# EAGLE design canBLC (EAGLE 5.11)
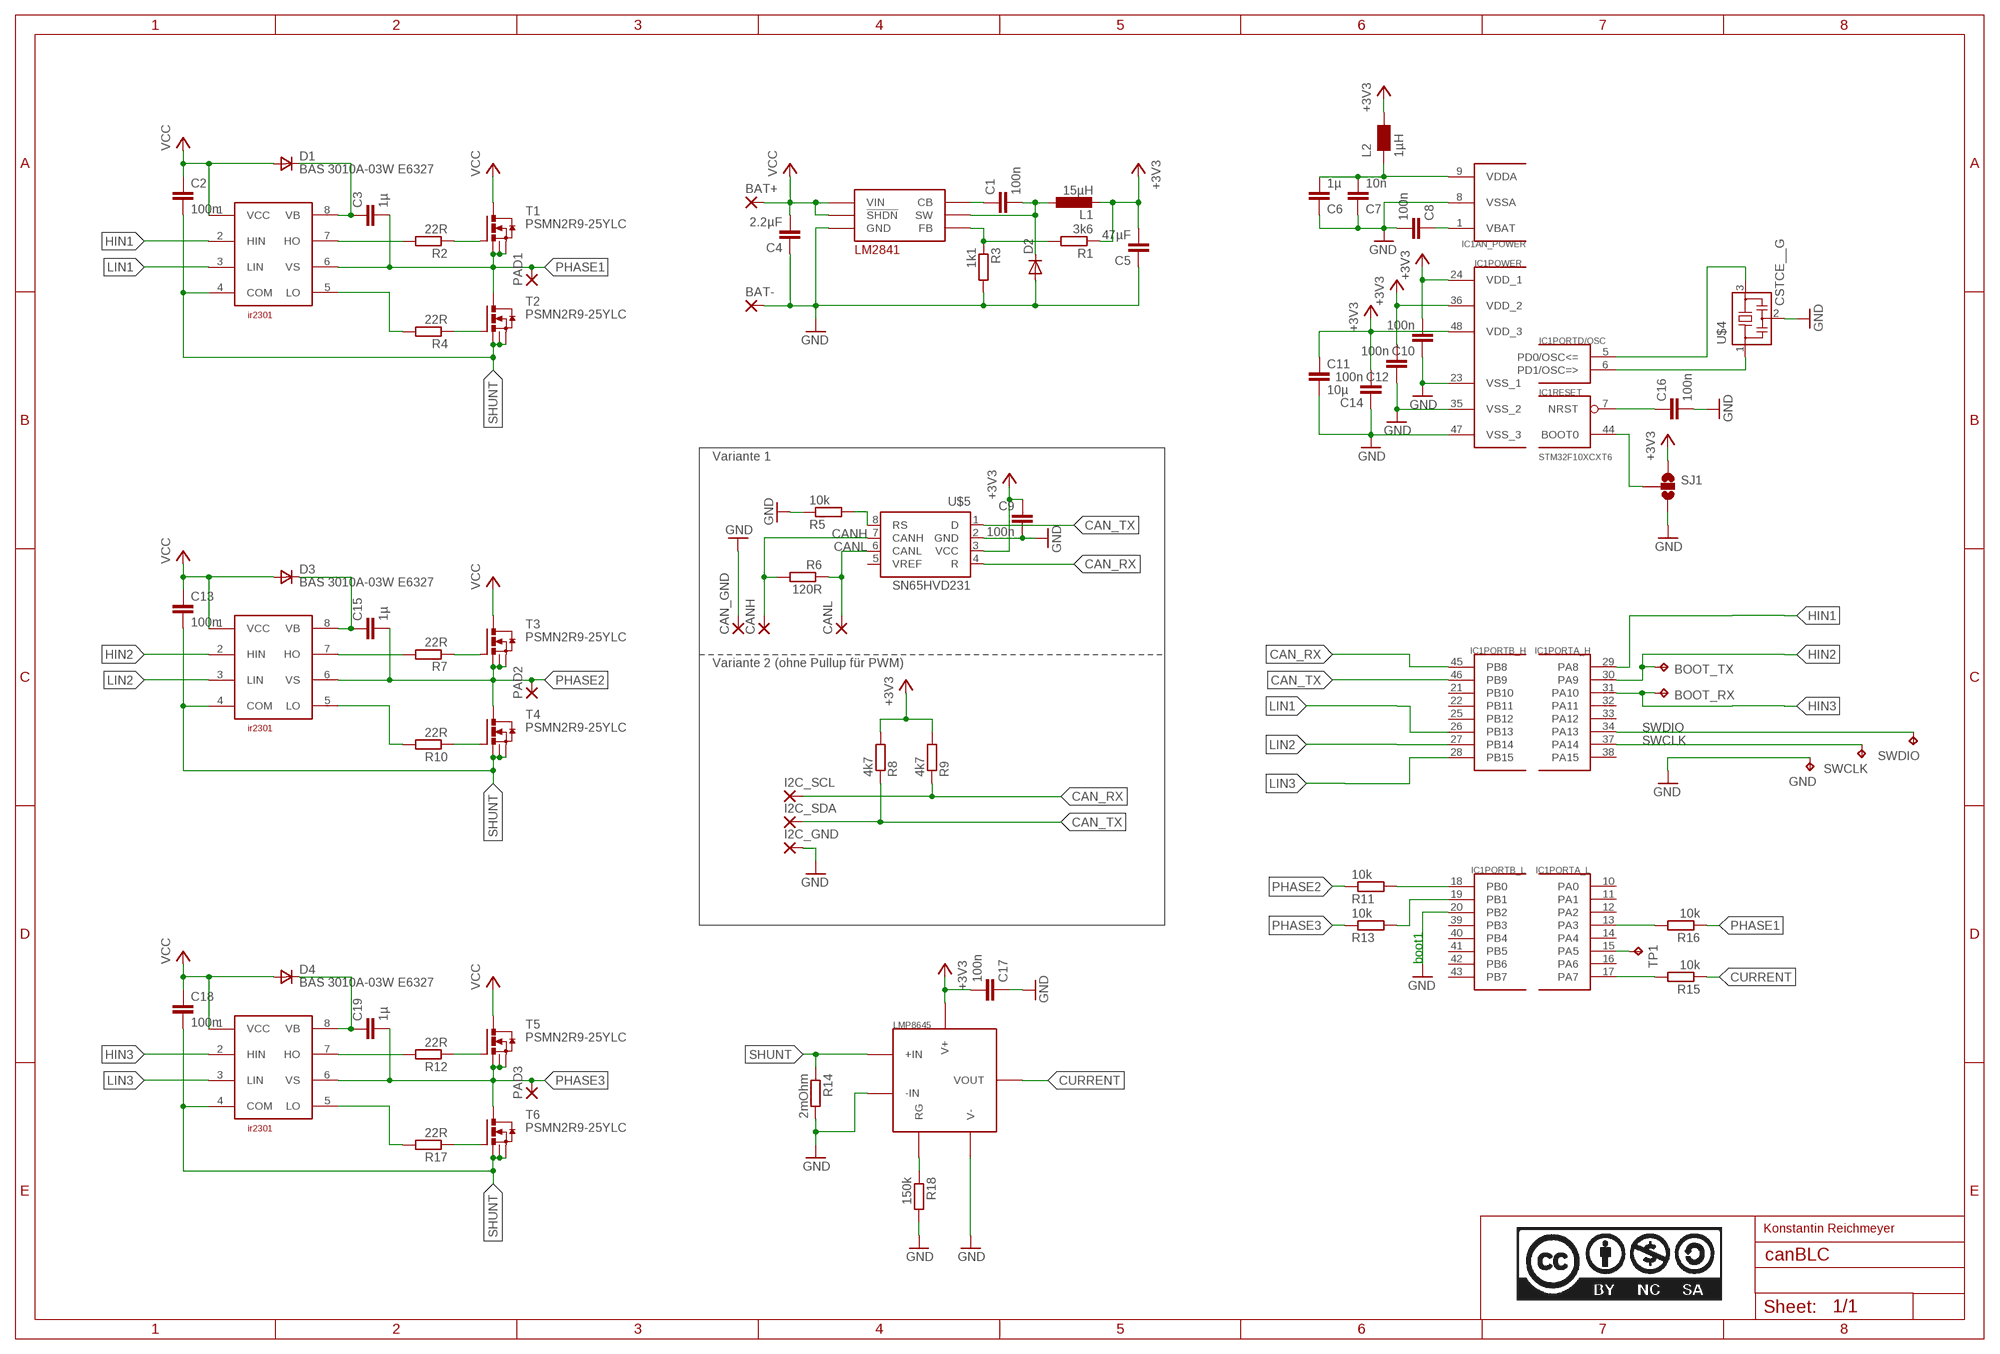
[diagram p0: schematic, sheet 1]

## Parts
BAT+  SMD5  [SMD2,54-5,08]
BAT-  SMD5  [SMD2,54-5,08]
BOOT_RX  TPB1,27  [B1,27]
BOOT_TX  TPB1,27  [B1,27]
C1  100n  C-EUC0805  [C0805]
C2  100n  C-EUC0805  [C0805]
C3  1µ  C-EUC0805  [C0805]
C4  2.2µF  C-EUC1206  [C1206]
C5  47µF  C-EUC1210  [C1210]
C6  1µ  C-EUC0805  [C0805]
C7  10n  C-EUC0805  [C0805]
C8  100n  C-EUC0805  [C0805]
C9  100n  C-EUC0805  [C0805]
C10  100n  C-EUC0805  [C0805]
C11  10µ  C-EUC0805  [C0805]
C12  100n  C-EUC0805  [C0805]
C13  100n  C-EUC0805  [C0805]
C14  100n  C-EUC0805  [C0805]
C15  1µ  C-EUC0805  [C0805]
C16  100n  C-EUC0805  [C0805]
C17  100n  C-EUC0805  [C0805]
C18  100n  C-EUC0805  [C0805]
C19  1µ  C-EUC0805  [C0805]
CAN_GND  WIREPADSMD1,27-254  [SMD1,27-2,54]
CANH  WIREPADSMD1,27-254  [SMD1,27-2,54]
CANL  WIREPADSMD1,27-254  [SMD1,27-2,54]
D1  BAS 3010A-03W E6327  DSOD323  [SOD323]
D2  CGRM4001-G  [SOD-123_MINI-SMA]
D3  BAS 3010A-03W E6327  DSOD323  [SOD323]
D4  BAS 3010A-03W E6327  DSOD323  [SOD323]
GND  TPB1,27  [B1,27]
I2C_GND  WIREPADSMD1,27-254  [SMD1,27-2,54]
I2C_SCL  WIREPADSMD1,27-254  [SMD1,27-2,54]
I2C_SDA  WIREPADSMD1,27-254  [SMD1,27-2,54]
IC1  STM32F10XCXT6  [TQFP48]
L1  15µH  L-EUL1812  [L1812]
L2  1µH  WE-KI_0805_B  [WE-KI_0805_B]
PAD1  SMD5  [SMD2,54-5,08]
PAD2  SMD5  [SMD2,54-5,08]
PAD3  SMD5  [SMD2,54-5,08]
R1  3k6  R-EU_R0805  [R0805]
R2  22R  R-EU_R0805  [R0805]
R3  1k1  R-EU_R0805  [R0805]
R4  22R  R-EU_R0805  [R0805]
R5  10k  R-EU_R0805  [R0805]
R6  120R  R-EU_R0805  [R0805]
R7  22R  R-EU_R0805  [R0805]
R8  4k7  R-EU_R0805  [R0805]
R9  4k7  R-EU_R0805  [R0805]
R10  22R  R-EU_R0805  [R0805]
R11  10k  R-EU_R0805  [R0805]
R12  22R  R-EU_R0805  [R0805]
R13  10k  R-EU_R0805  [R0805]
R14  2mOhm  R-EU_R2512  [R2512]
R15  10k  R-EU_R0805  [R0805]
R16  10k  R-EU_R0805  [R0805]
R17  22R  R-EU_R0805  [R0805]
R18  150k  R-EU_R0805  [R0805]
SJ1  SOLDERJUMPER_2WAYPASTE1&2  [SJ_3_PASTE1&2]
SWCLK  TPB1,27  [B1,27]
SWDIO  TPB1,27  [B1,27]
T1  PSMN2R9-25YLC  [SOT669]
T2  PSMN2R9-25YLC  [SOT669]
T3  PSMN2R9-25YLC  [SOT669]
T4  PSMN2R9-25YLC  [SOT669]
T5  PSMN2R9-25YLC  [SOT669]
T6  PSMN2R9-25YLC  [SOT669]
TP1  TPB1,27  [B1,27]
U1  IR2301  [SO08]
U2  IR2301  [SO08]
U3  IR2301  [SO08]
U$1  LM2841  [TSOP-6]
U$4  CSTCE__G  [CSTCE__G]
U$5  SN65HVD231  [SO-08]
U$9  LMP8645  [TSOP-6]

## Nets
+3V3: C5.2 C9.1 C10.2 C11.1 C12.2 C14.2 C17.2 IC1.24(POWER:VDD_1) IC1.36(POWER:VDD_2) IC1.48(POWER:VDD_3) L1.2 L2.1 R1.1 R8.2 R9.2 SJ1.1 U$5.3(VCC) U$9.6(V+)
CAN_RX: I2C_SCL.1(P) IC1.45(PORTB_H:PB8) R9.1 U$5.4(R)
CAN_TX: I2C_SDA.1(P) IC1.46(PORTB_H:PB9) R8.1 U$5.1(D)
CANH: CANH.1(P) R6.2 U$5.7(CANH)
CANL: CANL.1(P) R6.1 U$5.6(CANL)
CURRENT: R15.1 U$9.1(VOUT)
GND: BAT-.1(P) C4.1 C5.1 C6.1 C7.1 C8.2 C9.2 C10.1 C11.2 C12.1 C14.1 C16.2 C17.1 CAN_GND.1(P) D2.A GND.TP I2C_GND.1(P) IC1.8(AN_POWER:VSSA) IC1.20(PORTB_L:PB2) IC1.23(POWER:VSS_1) IC1.35(POWER:VSS_2) IC1.47(POWER:VSS_3) R3.2 R5.1 R14.2 R18.2 SJ1.3 U$1.2(GND) U$4.2 U$5.2(GND) U$9.2(V-) U$9.4(-IN)
HIN1: IC1.29(PORTA_H:PA8) U1.2(HIN)
HIN2: BOOT_TX.TP IC1.30(PORTA_H:PA9) U2.2(HIN)
HIN3: BOOT_RX.TP IC1.31(PORTA_H:PA10) U3.2(HIN)
LIN1: IC1.26(PORTB_H:PB13) U1.3(LIN)
LIN2: IC1.27(PORTB_H:PB14) U2.3(LIN)
LIN3: IC1.28(PORTB_H:PB15) U3.3(LIN)
N$2: R2.1 T1.4(G)
N$3: R4.1 T2.4(G)
N$4: R2.2 U1.7(HO)
N$5: R4.2 U1.5(LO)
N$6: C16.1 IC1.7(RESET:NRST)
N$7: IC1.5(PORTD/OSC:PD0/OSC<=) U$4.3
N$8: R5.2 U$5.8(RS)
N$9: R7.1 T3.4(G)
N$10: R10.1 T4.4(G)
N$11: R7.2 U2.7(HO)
N$12: R10.2 U2.5(LO)
N$13: IC1.18(PORTB_L:PB0) R11.2
N$14: IC1.19(PORTB_L:PB1) R13.2
N$15: IC1.13(PORTA_L:PA3) R16.2
N$16: IC1.17(PORTA_L:PA7) R15.2
N$17: R12.1 T5.4(G)
N$18: R17.1 T6.4(G)
N$19: R12.2 U3.7(HO)
N$20: R17.2 U3.5(LO)
N$21: IC1.15(PORTA_L:PA5) TP1.TP
N$22: IC1.6(PORTD/OSC:PD1/OSC=>) U$4.1
N$24: C8.1 IC1.1(AN_POWER:VBAT)
N$30: C6.2 C7.2 IC1.9(AN_POWER:VDDA) L2.2
N$31: IC1.44(RESET:BOOT0) SJ1.2
N$34: R18.1 U$9.5(RG)
N$35: C1.1 U$1.1(CB)
N$37: R1.2 R3.1 U$1.3(FB)
N$38: C1.2 D2.C L1.1 U$1.6(SW)
PHASE1: C3.2 PAD1.1(P) R16.1 T1.1(S) T1.2(S1) T1.3(S2) T2.5(D) U1.6(VS)
PHASE2: C15.2 PAD2.1(P) R11.1 T3.1(S) T3.2(S1) T3.3(S2) T4.5(D) U2.6(VS)
PHASE3: C19.2 PAD3.1(P) R13.1 T5.1(S) T5.2(S1) T5.3(S2) T6.5(D) U3.6(VS)
SHUNT: C2.2 C13.2 C18.2 R14.1 T2.1(S) T2.2(S1) T2.3(S2) T4.1(S) T4.2(S1) T4.3(S2) T6.1(S) T6.2(S1) T6.3(S2) U1.4(COM) U2.4(COM) U3.4(COM) U$9.3(+IN)
SWCLK: IC1.37(PORTA_H:PA14) SWCLK.TP
SWDIO: IC1.34(PORTA_H:PA13) SWDIO.TP
VB1: C3.1 D1.1(C) U1.8(VB)
VB2: C15.1 D3.1(C) U2.8(VB)
VB3: C19.1 D4.1(C) U3.8(VB)
VCC: BAT+.1(P) C2.1 C4.2 C13.1 C18.1 D1.2(A) D3.2(A) D4.2(A) T1.5(D) T3.5(D) T5.5(D) U1.1(VCC) U2.1(VCC) U3.1(VCC) U$1.4(!SHDN) U$1.5(VIN)
Unconnected: IC1.2(PORTC:PC13) IC1.3(PORTC:PC14) IC1.4(PORTC:PC15) IC1.10(PORTA_L:PA0) IC1.11(PORTA_L:PA1) IC1.12(PORTA_L:PA2) IC1.14(PORTA_L:PA4) IC1.16(PORTA_L:PA6) IC1.21(PORTB_H:PB10) IC1.22(PORTB_H:PB11) IC1.25(PORTB_H:PB12) IC1.32(PORTA_H:PA11) IC1.33(PORTA_H:PA12) IC1.38(PORTA_H:PA15) IC1.39(PORTB_L:PB3) IC1.40(PORTB_L:PB4) IC1.41(PORTB_L:PB5) IC1.42(PORTB_L:PB6) IC1.43(PORTB_L:PB7) U$5.5(VREF)

## Notes on the sheet
- Variante 1
- Variante 2 (ohne Pullup für PWM)
- boot1
- Konstantin Reichmeyer

## Library data of the parts
BAT+ BAT- PAD1-PAD3 = wirepad:SMD5: SMD PAD
BOOT_RX BOOT_TX GND SWCLK SWDIO TP1 = testpad:TP: Test pad
C1-C19 = rcl:C-EU: CAPACITOR, European symbol
CAN_GND CANH CANL I2C_GND I2C_SCL I2C_SDA = wirepad:WIREPAD: Wire PAD connect wire on PCB
D1 D3 D4 = zetex:D: DIODE; MPN: CDSOD323-T05C; OC_FARNELL: 1824860; OC_NEWARK: 79R6078
D2 = diode:CGRM400*-G: Molded plasitc,JEDEC SOD-123/Mini SMA Source: Comchip CGRM4001-G.pdf
IC1 = stm32:STM32F10XCXT6: ST STM32F101/103 48pin LQFP
L1 = rcl:L-EU: INDUCTOR, European symbol
L2 = wuerth-elektronik:WE-KI: SMD Wire Wound Ceramic Inductor WE-KI - Wire wound - High thermal stability - Rated current up to 1 A - High Q-factor - High SRF -- Especially developed for high frequency applications -- Perfect for applications in telecommunications -- Bluetooth -- Wireless LAN
R1-R18 = rcl:R-EU_: RESISTOR, European symbol
SJ1 = SparkFun:SOLDERJUMPER_2WAY: Solder Jumper 2 way solder jumper
T1-T6 = PSMN2R9-25YLC:PSMN2R9-25YLC
U1-U3 = ir:IR2301
U$1 = lm2841:LM2841
U$4 = murata-filter:CSTCE__G
U$5 = texas:SN65HVD231: 3.3-V CAN TRANSCEIVER http://focus.ti.com/lit/ds/symlink/sn65hvd232.pdf
U$9 = lmp8645:LMP8645

## Board
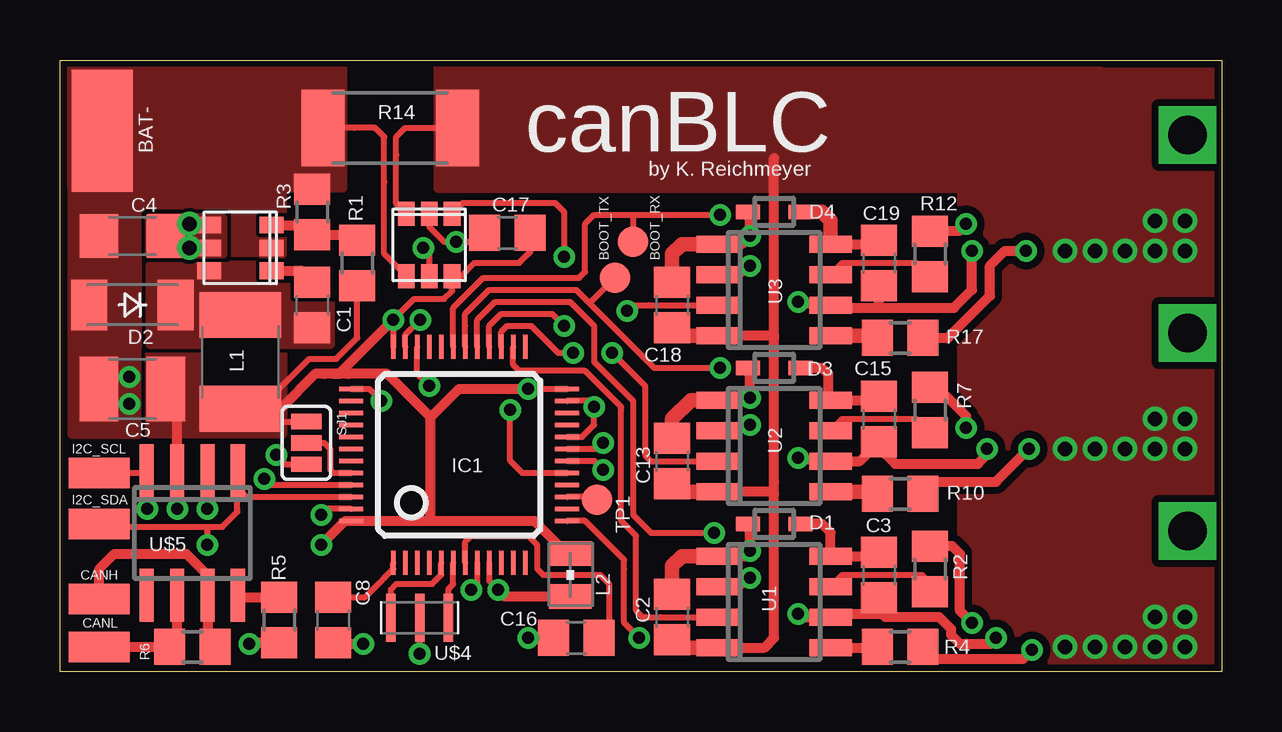
[diagram p1: board, top side]
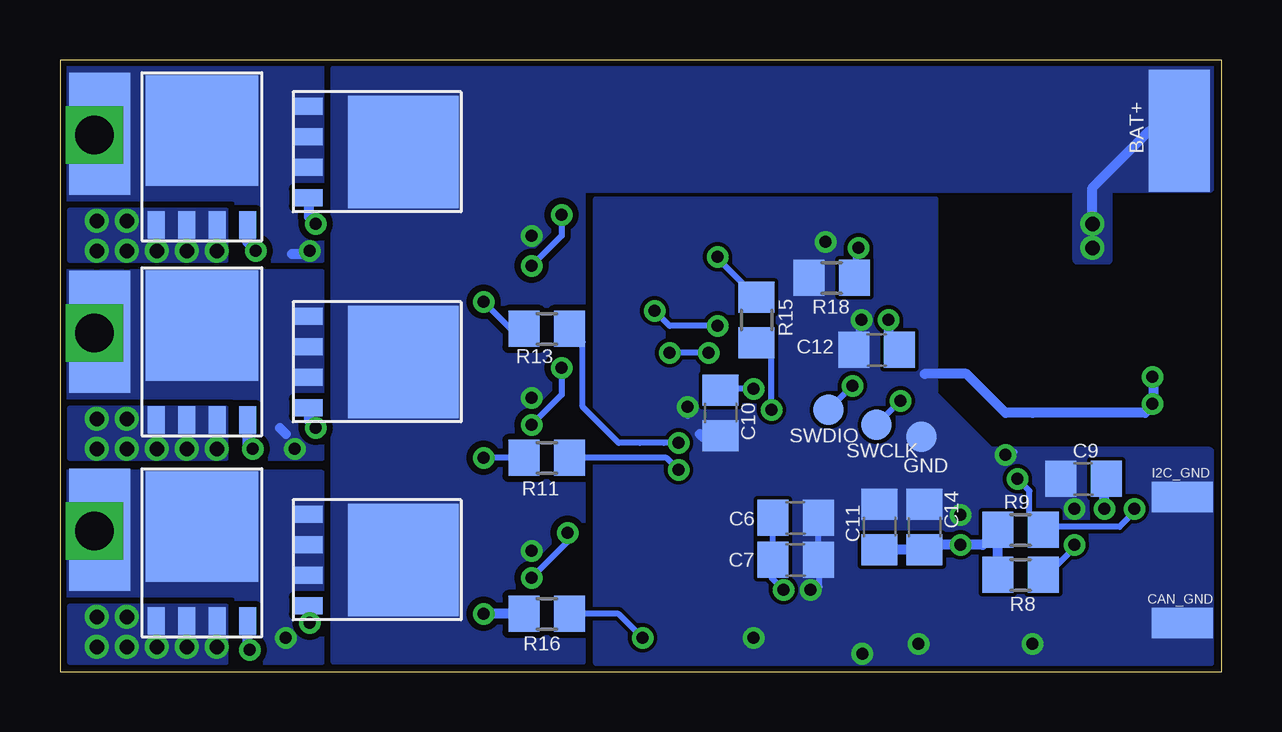
[diagram p2: board, bottom side, seen from below]

Size 48.43 x 25.49 mm. Coordinates in mm from the lower left corner, seen from the top.
Outline: 0,0 0,25.49 48.43,25.49 48.43,0 0,0
Copper layers (1*16): Top 0.035mm / dielectric 1.5mm / Bottom 0.035mm
Design rules "default *": minimum track width 6mil, minimum drill 19mil, track to track 6mil, track to pad 6mil, pad to pad 6mil, via to via 6mil, smd to smd 0mil, copper to edge 10mil, drill to drill 8mil, minimum pad ring 10mil, minimum via ring 8mil, stop-mask expansion 4mil, vias tented up to drill 0.6mm, thermal gap 10mil
tRestrict: area 5.9,11.9 to 9.1,13.9
bRestrict: area 5.9,11.9 to 9.1,13.9

### Footprints (pad centres in the part's own frame; a part is rotated, then mirrored left to right if it is on the bottom)
SMD2,54-5,08 = smd 2.54 x 5.08: 1 0,0
B1,27 = smd 1.27 x 1.27: TP 0,0
C0805 = smd 1.3 x 1.5: 1 -0.95,0; 2 0.95,0
C1206 = smd 1.6 x 1.8: 1 -1.4,0; 2 1.4,0
C1210 = smd 1.6 x 2.7: 1 -1.4,0; 2 1.4,0
SMD1,27-2,54 = smd 1.27 x 2.54: 1 0,0
SOD323 = smd 1 x 0.6: 1 -1.1,0; 2 1.1,0
SOD-123_MINI-SMA = smd 1.5 x 2.1: A 1.8,0; C -1.8,0
TQFP48 = smd 0.2 x 1: 1 -2.75,-4.5; 2 -2.25,-4.5; 3 -1.75,-4.5; 4 -1.25,-4.5; 5 -0.75,-4.5; 6 -0.25,-4.5; 7 0.25,-4.5; 8 0.75,-4.5; 9 1.25,-4.5; 10 1.75,-4.5; 11 2.25,-4.5; 12 2.75,-4.5; 25 2.75,4.5; 26 2.25,4.5; 27 1.75,4.5; 28 1.25,4.5; 29 0.75,4.5; 30 0.25,4.5; 31 -0.25,4.5; 32 -0.75,4.5; 33 -1.25,4.5; 34 -1.75,4.5; 35 -2.25,4.5; 36 -2.75,4.5 | smd 1 x 0.2: 13 4.5,-2.75; 14 4.5,-2.25; 15 4.5,-1.75; 16 4.5,-1.25; 17 4.5,-0.75; 18 4.5,-0.25; 19 4.5,0.25; 20 4.5,0.75; 21 4.5,1.25; 22 4.5,1.75; 23 4.5,2.25; 24 4.5,2.75; 37 -4.5,2.75; 38 -4.5,2.25; 39 -4.5,1.75; 40 -4.5,1.25; 41 -4.5,0.75; 42 -4.5,0.25; 43 -4.5,-0.25; 44 -4.5,-0.75; 45 -4.5,-1.25; 46 -4.5,-1.75; 47 -4.5,-2.25; 48 -4.5,-2.75
L1812 = smd 1.9 x 3.4: 1 -1.95,0; 2 1.95,0
WE-KI_0805_B = smd 1.02 x 1.78: 1 -0.89,0; 2 0.89,0
R0805 = smd 1.3 x 1.5: 1 -0.95,0; 2 0.95,0
R2512 = smd 1.8 x 3.2: 1 -2.8,0; 2 2.8,0
SJ_3_PASTE1&2 = smd 0.635 x 1.27: 1 -0.889,0; 2 0,0; 3 0.889,0
SOT669 = smd 0.7 x 1.15: 1 -1.905,-2.54; 2 -0.635,-2.54; 3 0.635,-2.54; 4 1.905,-2.54 | smd 4.7 x 4.6: 5 0,1.397
SO08 = smd 0.72 x 1.78: 1 -1.905,-2.35; 2 -0.635,-2.35; 3 0.635,-2.35; 4 1.905,-2.35; 5 1.905,2.35; 6 0.635,2.35; 7 -0.635,2.35; 8 -1.905,2.35
TSOP-6 = smd 0.69 x 1: 1 0.95,1.3; 2 0,1.3; 3 -0.95,1.3; 4 -0.95,-1.3; 5 0,-1.3; 6 0.95,-1.3
CSTCE__G = smd 0.4 x 2: 1 -1.2,0; 2 0,0; 3 1.2,0
SO-08 = smd 0.6 x 2.2: 1 -1.905,-2.6; 2 -0.635,-2.6; 3 0.635,-2.6; 4 1.905,-2.6; 5 1.905,2.6; 6 0.635,2.6; 7 -0.635,2.6; 8 -1.905,2.6

### Placement (x,y rotation side)
BAT+  1.77,22.54 180 bottom
BAT-  1.77,22.54 180 top
BOOT_RX  23.89,17.91 0 top
BOOT_TX  23.14,16.41 0 top
C1  10.52,15.29 270 top
C2  25.52,2.29 270 top
C3  34.14,4.04 270 top
C4  3.02,18.16 0 top
C5  3.02,11.79 0 top
C6  17.77,6.41 180 bottom
C7  17.77,4.66 180 bottom
C8  11.39,2.16 270 top
C9  5.77,8.04 180 bottom
C10  20.89,10.79 90 bottom
C11  14.27,6.04 90 bottom
C12  14.39,13.41 0 bottom
C13  25.52,8.79 270 top
C14  12.39,6.04 270 bottom
C15  34.14,10.54 270 top
C16  21.52,1.41 180 top
C17  18.64,18.29 0 top
C18  25.52,15.29 270 top
C19  34.14,17.04 270 top
CAN_GND  1.64,2.04 90 bottom
CANH  1.64,3.04 90 top
CANL  1.64,1.04 90 top
D1  29.77,6.16 180 top
D2  3.02,15.29 180 top
D3  29.77,12.66 180 top
D4  29.77,19.16 180 top
GND  12.52,9.79 0 bottom
I2C_GND  1.64,7.29 270 bottom
I2C_SCL  1.64,8.29 270 top
I2C_SDA  1.64,6.16 270 top
IC1  16.64,9.04 0 top
L1  7.52,12.91 270 top
L2  21.27,4.04 270 top
PAD1  46.77,5.91 180 bottom
PAD2  46.77,14.16 180 bottom
PAD3  46.77,22.41 180 bottom
R1  12.39,17.04 90 top
R2  36.27,4.29 270 top
R3  10.52,19.16 90 top
R4  35.02,1.04 180 top
R5  9.14,2.16 90 top
R6  5.52,1.04 0 top
R7  36.27,10.91 270 top
R8  8.39,4.04 180 bottom
R9  8.39,5.91 180 bottom
R10  35.02,7.41 180 top
R11  28.14,8.91 0 bottom
R12  36.27,17.41 270 top
R13  28.14,14.29 0 bottom
R14  13.77,22.66 180 top
R15  19.39,14.66 270 bottom
R16  28.14,2.41 0 bottom
R17  35.02,13.91 180 top
R18  16.27,16.41 180 bottom
SJ1  10.27,9.54 270 top
SWCLK  14.39,10.29 0 bottom
SWDIO  16.39,10.91 0 bottom
T1  35.52,4.66 270 bottom
T2  42.52,4.66 0 bottom
T3  35.52,12.91 270 bottom
T4  42.52,13.04 0 bottom
T5  35.52,21.66 270 bottom
T6  42.52,21.16 0 bottom
TP1  22.39,7.16 90 top
U1  29.77,2.91 270 top
U2  29.77,9.41 270 top
U3  29.77,15.91 270 top
U$1  7.52,17.66 270 top
U$4  14.99,2.25 180 top
U$5  5.52,5.79 180 top
U$9  15.39,17.79 0 top

### Tracks (layer width: path | path; a pad name or v marks a point on that pad's centre or on a via)
+3V3  (via drill 0.5)
  Top 0.254: IC1.24 20.14,11.79 20.02,11.79 v19.52,11.79 | v4.89,6.79 v4.88,6.8 | 4.88,10.53 4.89,10.54 | C17.2 19.59,17.49 19.52,17.41 19.14,17.04 17.27,17.04 16.72,16.49 U$9.6 16.34,15.86 16.02,15.54 14.77,15.54 v13.89,14.66 IC1.36 | SJ1.1 9.27,10.43 8.06,10.43 L1.2 | R1.1 12.39,13.91 11.52,13.04 10.39,13.04 9.02,11.66 9.02,11.59 8.39,10.96
  Top 0.406: v4.88,6.8 U$5.3 4.88,10.53 | L2.1 21.13,4.93 19.77,6.29 15.39,6.29 | 13.89,12.16 15.08,10.97 15.46,10.6 | 13.89,12.16 14.27,11.79 | 15.39,6.29 15.27,6.29 IC1.48 11.89,6.29 v10.89,5.29 | v19.52,11.79 16.64,11.79 15.46,10.6 | 15.46,10.6 15.46,6.35 15.39,6.29 | 13.89,12.16 13.64,12.41 12.02,12.41 11.39,12.41 | 11.39,12.41 11.02,12.41 10.64,12.41 9.19,10.96 | 8.64,10.96 8.39,10.96 L1.2 | 9.19,10.96 8.64,10.96 | v13.89,14.66 11.64,12.41 11.39,12.41 | 9.19,10.96 8.64,10.96
  Bottom 0.254: v19.52,11.79 20.89,11.79 C10.2 | R9.2 9.34,5.79 | 4.89,7.96 C9.1
  Bottom 0.406: C11.1 C14.2 12.19,5.29 v10.89,5.29 9.97,5.29 R9.2 R8.2 | 13.89,13.86 C12.2 | 13.89,13.86 v13.89,14.66 13.89,13.86 | v4.89,6.79 4.89,7.96
  pour Top (rank 3, no thermals): 9.27,14.16 9.27,9.91 3.77,9.91 3.77,14.16
CAN_RX  (via drill 0.5)
  Top 0.254: v8.52,8.04 8.77,7.79 IC1.45 | U$5.4 3.71,8.29 | U$5.4 3.51,8.29 I2C_SCL.1 | v3.64,6.79 3.64,8.36 U$5.4
  Bottom 0.254: v8.52,8.04 8.02,7.54 8.02,6.54 7.52,6.04 | 7.52,6.04 4.27,6.04 3.64,6.66 v3.64,6.79 | 7.52,6.04 7.52,5.99 R9.1
CAN_TX  (via drill 0.5)
  Top 0.254: 7.39,7.66 7.52,7.54 7.77,7.29 9.02,7.29 11.27,7.29 IC1.46 | 7.39,7.66 7.39,8.36 U$5.1 | 7.39,7.66 7.39,6.79 7.39,6.66 6.77,6.04 6.27,6.04 | I2C_SDA.1 1.77,6.04 5.89,6.04 6.14,6.04 | 6.14,6.04 6.27,6.04 | 6.14,6.04 6.27,6.04 | 6.14,6.04 v6.14,5.29
  Bottom 0.254: R8.1 7.27,4.04 6.14,5.16 v6.14,5.29
CANH
  Top 0.406: R6.2 6.15,1.35 U$5.7 6.15,4.03 5.27,4.91 2.27,4.91 1.64,4.29 CANH.1 1.64,3.29
CANL
  Top 0.406: U$5.6 4.88,1.35 R6.1 CANL.1
CURRENT  (via drill 0.5)
  Top 0.254: U$9.1 16.79,19.54 20.64,19.54 21.02,19.16 v21.02,17.29
  Bottom 0.254: R15.1 21.02,17.24 v21.02,17.29
GND  (via drill 0.5)
  Top 0.254: R14.2 12.27,22.66 13.14,22.66 13.52,22.29 13.52,20.41 13.52,17.41 U$9.4 | IC1.47 11.14,6.79 v10.89,6.54 | IC1.8 17.39,3.66 17.27,3.54 v17.14,3.41 | IC1.35 14.39,14.04 v15.02,14.66 | IC1.23 22.02,11.29 v22.27,11.04 22.27,10.29 21.77,9.79 IC1.20 | v19.52,1.41 C16.2 | v16.52,17.91 17.07,17.91 | U$9.2 15.39,18.54 16.02,17.91 v16.52,17.91 | C17.1 17.32,17.91 v16.52,17.91 | SJ1.3 9.41,8.65 v9.02,9.04 | U$4.2 v14.99,0.75
  Top 0.406: R5.1 7.94,1.21 v7.89,1.16 | U$5.2 6.14,8.38 v6.14,6.79 | C8.2 11.44,1.16 v12.64,1.16
  Bottom 0.254: C7.1 C6.1 | v17.14,3.41 16.89,3.41 16.77,3.54 16.77,4.66 | v15.02,14.66 15.14,14.54 15.14,13.29 | 20.89,9.79 IC1.20 21.39,9.79 | v22.27,11.04 22.27,10.66 | 16.77,4.66 16.77,4.74 16.77,4.66 | v9.02,9.04 8.77,9.04 8.64,9.16 | 16.77,4.66 16.89,4.66
  Bottom 0.406: 21.77,9.91 21.64,9.79 | 21.27,9.91 IC1.20 | 12.39,12.41 10.64,12.41 9.02,10.79 7.89,10.79 3.21,10.79 2.87,11.12 2.87,12.29 v2.89,12.29
  other vias: 2.89,11.16
  pour Top (no thermals): 11.77,20.16 0.52,20.16 0.52,25.16 11.77,25.16
  pour Top (rank 4, no thermals): 3.27,9.91 3.27,19.41 0.52,19.41 0.52,9.91
  pour Top (rank 4, no thermals): 9.27,17.41 9.27,21.16 0.52,21.16 0.52,17.41
  pour Bottom (rank 5, no thermals): 12.02,19.66 26.02,19.66 26.02,0.41 0.52,0.41 0.52,9.16 9.64,9.16 12.02,11.54
HIN1  (via drill 0.5)
  Top 0.254: U1.2 28.4,3.55 v28.77,3.91 | v27.27,5.79 25.52,5.79 24.64,5.79 23.89,6.54 23.89,8.91 23.89,11.29 22.27,12.91 22.27,14.41 21.27,15.41 20.39,15.41 19.39,15.41 18.14,15.41 17.77,15.04 17.39,14.66 IC1.29
  Bottom 0.254: v27.27,5.79 27.27,5.41 v28.77,3.91
HIN2  (via drill 0.5)
  Top 0.254: U2.2 28.53,10.05 v28.77,10.29 | v27.52,12.66 26.02,12.66 25.64,12.66 25.27,12.66 24.77,12.66 23.27,14.16 23.14,14.29 22.77,14.66 22.27,15.16 22.08,15.35 | IC1.30 16.89,14.41 16.89,14.91 17.89,15.91 21.39,15.91 21.52,15.91 22.08,15.35 | 22.08,15.35 BOOT_TX.TP
  Bottom 0.254: 28.64,10.41 v28.77,10.29 27.52,11.54 v27.52,12.66
HIN3  (via drill 0.5)
  Top 0.254: U3.2 28.4,16.55 v28.77,16.91 | IC1.31 16.39,15.16 17.64,16.41 21.64,16.41 21.89,16.66 21.89,18.66 22.27,19.04 23.89,19.04 | 23.89,19.04 v27.52,19.04 | 23.89,19.04 BOOT_RX.TP
  Bottom 0.254: v28.77,16.91 27.52,18.16 v27.52,19.04
LIN1
  Top 0.254: U1.3 25.03,2.28 24.39,2.28 24.28,2.28 24.27,2.29 24.02,2.54 24.02,5.66 23.39,6.29 23.39,10.91 23.39,11.04 21.89,12.54 19.14,12.54 18.89,12.79 IC1.26
LIN2  (via drill 0.5)
  Top 0.254: U2.3 24.64,8.78 24.39,9.03 24.39,11.16 24.39,11.91 v23.02,13.29 | IC1.27 18.39,14.16 18.64,14.41 19.64,14.41 20.77,13.29 v21.39,13.29
  Bottom 0.254: v21.39,13.29 v23.02,13.29
LIN3  (via drill 0.5)
  Top 0.254: U3.3 24.52,15.28 23.88,15.28 v23.64,15.04 | IC1.28 17.89,14.41 18.39,14.91 20.52,14.91 v21.02,14.41
  Bottom 0.254: v21.02,14.41 23.02,14.41 23.52,14.91 v23.64,15.04
N$2  (via drill 0.5)
  Top 0.406: v38.02,2.04 37.52,2.54 37.52,4.91 37.19,5.24 R2.1
  Bottom 0.406: T1.4 38.06,2.08 v38.02,2.04
N$3  (via drill 0.5)
  Top 0.406: v40.52,0.91 40.14,0.54 36.77,0.54 36.59,0.54 36.47,0.54 R4.1
  Bottom 0.406: T2.4 40.61,1.01 v40.52,0.91
N$4
  Top 0.254: 32.23,3.66 U1.7 32.61,4.04 35.52,4.04 35.94,4.04 36.27,3.71 R2.2
N$5
  Top 0.406: R4.2 34.04,1.01 U1.5
N$6
  Top 0.254: IC1.7 16.89,5.16 | 16.89,5.16 16.89,5.29 | 16.89,5.16 16.89,5.41 17.02,5.54 17.14,5.66 19.52,5.66 19.89,5.29 19.89,4.29 20.14,4.04 22.52,4.04 22.89,3.66 22.89,2.54 22.89,1.84 C16.1
N$7
  Top 0.254: IC1.5 15.89,4.04 15.52,3.66 14.02,3.66 13.79,3.44 U$4.3
N$8
  Top 0.406: R5.2 7.5,3.11 U$5.8
N$9  (via drill 0.5)
  Top 0.406: R7.1 36.57,11.86 37.52,10.91 37.77,10.66 v37.77,10.16
  Bottom 0.406: v37.77,10.16 38.06,10.45 T3.4
N$10  (via drill 0.5)
  Top 0.406: R10.1 36.02,7.41 36.52,7.91 38.77,7.91 39.02,7.91 v40.39,9.29
  Bottom 0.406: T4.4 40.61,9.51 v40.39,9.29
N$11
  Top 0.254: 36.27,9.66 R7.2 35.69,10.54 35.39,10.54 32.61,10.54 32.23,10.16
  Top 0.406: U2.7 32.23,10.16
N$12
  Top 0.61: U2.5 33.97,7.51 R10.2
N$13  (via drill 0.5)
  Top 0.254: IC1.18 21.77,8.79 22.27,8.79 v22.64,8.41
  Bottom 0.254: R11.2 23.14,8.91 v22.64,8.41
N$14  (via drill 0.5)
  Top 0.254: IC1.19 22.39,9.29 v22.64,9.54
  Bottom 0.254: R13.2 26.64,13.74 26.64,11.04 26.39,10.79 25.14,9.54 24.27,9.54 23.27,9.54 v22.64,9.54
N$15  (via drill 0.5)
  Top 0.254: v24.14,1.41 23.52,2.04 23.52,4.29 23.52,4.66 21.89,6.29 IC1.13
  Bottom 0.254: R16.2 25.14,2.41 v24.14,1.41
N$16  (via drill 0.5)
  Top 0.254: IC1.17 19.27,8.29 18.77,8.79 v18.77,10.91
  Bottom 0.254: v18.77,10.91 18.77,13.09 R15.2
N$17  (via drill 0.5)
  Top 0.406: v37.77,18.66 37.47,18.36 R12.1
  Bottom 0.406: T5.4 38.06,18.95 v37.77,18.66
N$18  (via drill 0.5)
  Top 0.406: R17.1 37.02,13.91 38.77,15.66 38.77,16.91 39.39,17.54 v40.27,17.54
  Bottom 0.406: T6.4 40.61,17.88 v40.27,17.54
N$19
  Top 0.254: R12.2 35.69,17.04 33.77,17.04 32.61,17.04 U3.7
N$20
  Top 0.61: U3.5 33.97,14.01 R17.2
N$21
  Top 0.254: IC1.15 22.27,7.29 TP1.TP
N$22
  Top 0.254: U$4.1 16.19,3.45 16.24,3.5 16.39,3.65 IC1.6
N$24
  Top 0.254: IC1.1 13.89,4.29 13.52,3.91 13.34,3.74 12.72,3.11 C8.1
N$30  (via drill 0.5)
  Top 0.254: IC1.9 17.89,3.79 v18.27,3.41
  Top 0.406: L2.2 18.53,3.15 v18.27,3.41
  Bottom 0.254: v18.27,3.41 18.64,3.79 18.77,3.91 18.77,4.66 18.77,4.69 18.72,4.74 C7.2 18.72,6.04 C6.2 18.72,6.61 18.77,6.66
N$31
  Top 0.254: IC1.44 11.39,8.29 11.27,8.41 11.27,9.29 11.02,9.54 SJ1.2
N$34  (via drill 0.5)
  Top 0.254: U$9.5 15.39,17.41 v15.14,17.66
  Bottom 0.254: R18.1 15.27,16.46 15.27,17.54 v15.14,17.66
N$35
  Top 0.406: C1.1 10.04,16.71 U$1.1
N$37
  Top 0.406: U$1.3 10.12,18.61 R3.1 | R3.1 10.97,18.21 | R1.2 12.17,18.21 R3.1
N$38
  pour Top (rank 2, no thermals): 11.27,13.66 11.27,16.91 3.77,16.91 3.77,13.66
PHASE1  (via drill 0.5, 1.6)
  Top 0.406: v39.02,1.41 38.77,1.16 37.52,1.16 37.14,1.54 37.14,1.79 36.64,2.29 34.39,2.29 34.14,2.54 | v30.77,2.41 30.9,2.28 U1.6 32.25,2.41 34.14,2.41 34.14,2.54 | 34.14,2.54 C3.2
  Bottom 0.406: R16.1 v30.77,2.41
  other vias: 46.99,5.87
  pour Bottom (isolate 0.254, rank 2, no thermals): 48.52,0.41 37.52,0.41 37.52,8.29 48.52,8.29
PHASE2  (via drill 0.5, 1.6)
  Top 0.254: U2.6 30.9,8.78 v30.77,8.91
  Top 0.406: v38.64,9.29 38.64,9.04 38.27,8.66 34.82,8.66 34.14,9.34 C15.2 33.33,8.78 U2.6
  Bottom 0.254: R11.1 v30.77,8.91
  Bottom 0.406: 39.02,9.91 39.27,10.16
  other vias: 46.99,14.12
  pour Bottom (isolate 0.254, rank 3, no thermals): 48.52,8.91 37.52,8.91 37.52,16.66 48.52,16.66
PHASE3  (via drill 0.5, 1.6)
  Top 0.254: U3.6 30.9,15.28 v30.77,15.41
  Top 0.406: v38.02,17.54 38.02,15.91 37.27,15.16 34.14,15.16 | U3.6 32.13,15.28 32.25,15.16 34.14,15.16 | 34.14,15.16 C19.2
  Bottom 0.254: v30.77,15.41 29.64,14.29 R13.1
  Bottom 0.406: 38.77,17.41 38.27,17.41
  other vias: 46.99,22.37
  pour Bottom (isolate 0.254, rank 2, no thermals): 48.52,17.16 37.52,17.16 37.52,25.16 48.52,25.16
SHUNT  (via drill 0.6)
  Top 0.254: R14.1 14.39,22.66 14.02,22.29 14.02,21.54 14.02,19.51 U$9.3
  Top 0.406: 25.85,14.01 29.17,14.01 29.77,14.01 29.77,13.91 | 29.77,7.41 29.77,1.41 29.36,1.01 U1.4 | 29.77,7.41 29.77,7.91 29.77,13.41 29.77,13.91 | U2.4 29.67,7.51 29.77,7.41 | 29.77,13.91 29.77,21.41
  Top 0.61: C2.2 25.85,1.01 U1.4 | U2.4 25.85,7.51 C13.2 | U3.4 25.85,14.01 C18.2
  other vias: 41.89,9.29 43.14,9.29 44.39,9.29 45.64,9.29 45.64,10.54 41.89,17.54 43.14,17.54 44.39,17.54 45.64,17.54 45.64,18.79 41.89,1.04 43.14,1.04 44.39,1.04 45.64,1.04 45.64,2.29 46.89,18.79 46.89,17.54 46.89,10.54 46.89,9.29 46.89,2.29 46.89,1.04
  pour Bottom (isolate 0.254, no thermals): 41.52,19.21 48.02,19.21 48.02,17.16 41.52,17.16
  pour Bottom (isolate 0.254, no thermals): 41.52,10.96 48.02,10.96 48.02,8.91 41.52,8.91
  pour Bottom (isolate 0.254, no thermals): 41.52,2.71 48.02,2.71 48.02,0.41 41.52,0.41
  pour Top (isolate 0.305): 48.02,0.41 48.02,25.16 37.52,25.16 37.52,0.41
  pour Top (no thermals): 15.77,20.16 43.27,20.16 43.27,25.16 15.77,25.16
SWCLK  (via drill 0.5)
  Top 0.254: IC1.37 12.89,11.79 v13.39,11.29
  Bottom 0.254: v13.39,11.29 SWCLK.TP
SWDIO  (via drill 0.5)
  Top 0.254: v15.39,11.91 14.89,12.41 IC1.34
  Bottom 0.254: v15.39,11.91 SWDIO.TP
VB1
  Top 0.406: D1.1 31.77,6.16 32.12,5.81 U1.8 33.97,4.82 C3.1
VB2
  Top 0.406: D3.1 31.77,12.66 32.02,12.41 32.02,11.42 U2.8 33.97,11.32 C15.1
VB3
  Top 0.406: C19.1 33.97,17.82 U3.8
  Top 0.61: U3.8 32.12,18.81 31.77,19.16 D4.1
VCC  (via drill 0.5, 0.6)
  Top 0.406: U2.1 27.51,11.41 v28.77,11.41 28.77,12.66 D3.2 | U1.1 28.55,4.82 v28.77,5.04 28.77,6.16 D1.2 | U3.1 28.42,17.82 v28.77,18.16 28.77,19.16 D4.2 | 4.89,18.16 C4.2 4.89,18.16 | 4.89,18.16 v5.39,18.66 5.44,18.61 U$1.4 | 4.89,18.16 v5.39,17.66 U$1.5
  Top 0.61: U1.1 25.92,4.82 25.52,4.41 C2.1 | U2.1 26.3,11.32 25.52,10.54 C13.1 | U3.1 25.92,17.82 25.52,17.41 C18.1
  Bottom 0.406: BAT+.1 3.02,22.54 5.39,20.16 v5.39,18.66
  pour Bottom (isolate 0.254, no thermals): 37.02,25.16 26.64,25.16 26.64,0.41 37.02,0.41
  pour Bottom (isolate 0.254, no thermals): 33.52,20.16 0.52,20.16 0.52,25.16 33.52,25.16
  pour Top (no thermals): 6.77,18.91 6.77,17.41 3.77,17.41 3.77,18.91
  pour Bottom: 4.77,17.16 6.02,17.16 6.02,19.91 4.77,19.91

### Text on the board
tNames: BAT- | canBLC | by K. Reichmeyer
bNames: BAT+